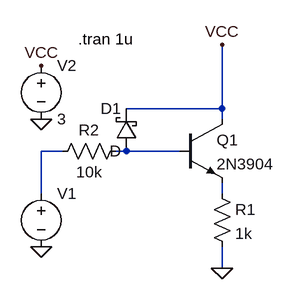
[diagram p0: schematic Test (If Spice works) 2N3904.asc]
Test (If Spice works) 2N3904.asc, the LTspice schematic file:
Version 4.1
SHEET 1 880 732
WIRE 320 80 320 -16
WIRE 320 80 176 80
WIRE 320 96 320 80
WIRE 80 144 48 144
WIRE 176 144 160 144
WIRE 256 144 176 144
WIRE 48 208 48 144
WIRE 320 208 320 192
WIRE 320 320 320 288
FLAG 320 320 0
FLAG 320 -16 VCC
FLAG 48 288 0
FLAG 48 16 VCC
FLAG 48 96 0
SYMBOL res 304 192 R0
SYMATTR InstName R1
SYMATTR Value 1k
SYMBOL res 64 160 R270
WINDOW 0 32 56 VTop 2
WINDOW 3 0 56 VBottom 2
SYMATTR InstName R2
SYMATTR Value 10k
SYMBOL voltage 48 192 R0
WINDOW 123 0 0 Left 0
WINDOW 39 0 0 Left 0
WINDOW 3 24 96 Invisible 2
SYMATTR Value PULSE(-0.5 10.6 100n 1n 1n 300n 100u)
SYMATTR InstName V1
SYMBOL voltage 48 0 R0
WINDOW 123 0 0 Left 0
WINDOW 39 0 0 Left 0
SYMATTR InstName V2
SYMATTR Value 3
SYMBOL npn 256 96 R0
SYMATTR InstName Q1
SYMATTR Value 2N3904
SYMBOL schottky 192 144 R180
WINDOW 0 24 64 Left 2
WINDOW 3 24 0 Left 2
SYMATTR InstName D1
TEXT 104 -24 Left 2 !.tran 1u

The netlist it stands for:
* Test (If Spice works) 2N3904.asc
R1 N003 0 1k
R2 N001 N002 10k
V1 N001 0 PULSE(-0.5 10.6 100n 1n 1n 300n 100u)
V2 VCC 0 3
Q1 VCC N002 N003 0 2N3904
D1 N002 VCC D
.model D D
.lib standard.dio
.model NPN NPN
.model PNP PNP
.lib standard.bjt
.tran 1u
.backanno
.end